# EAGLE design BaseMachine_Sequencer_UI_2 (EAGLE 7.2.0)
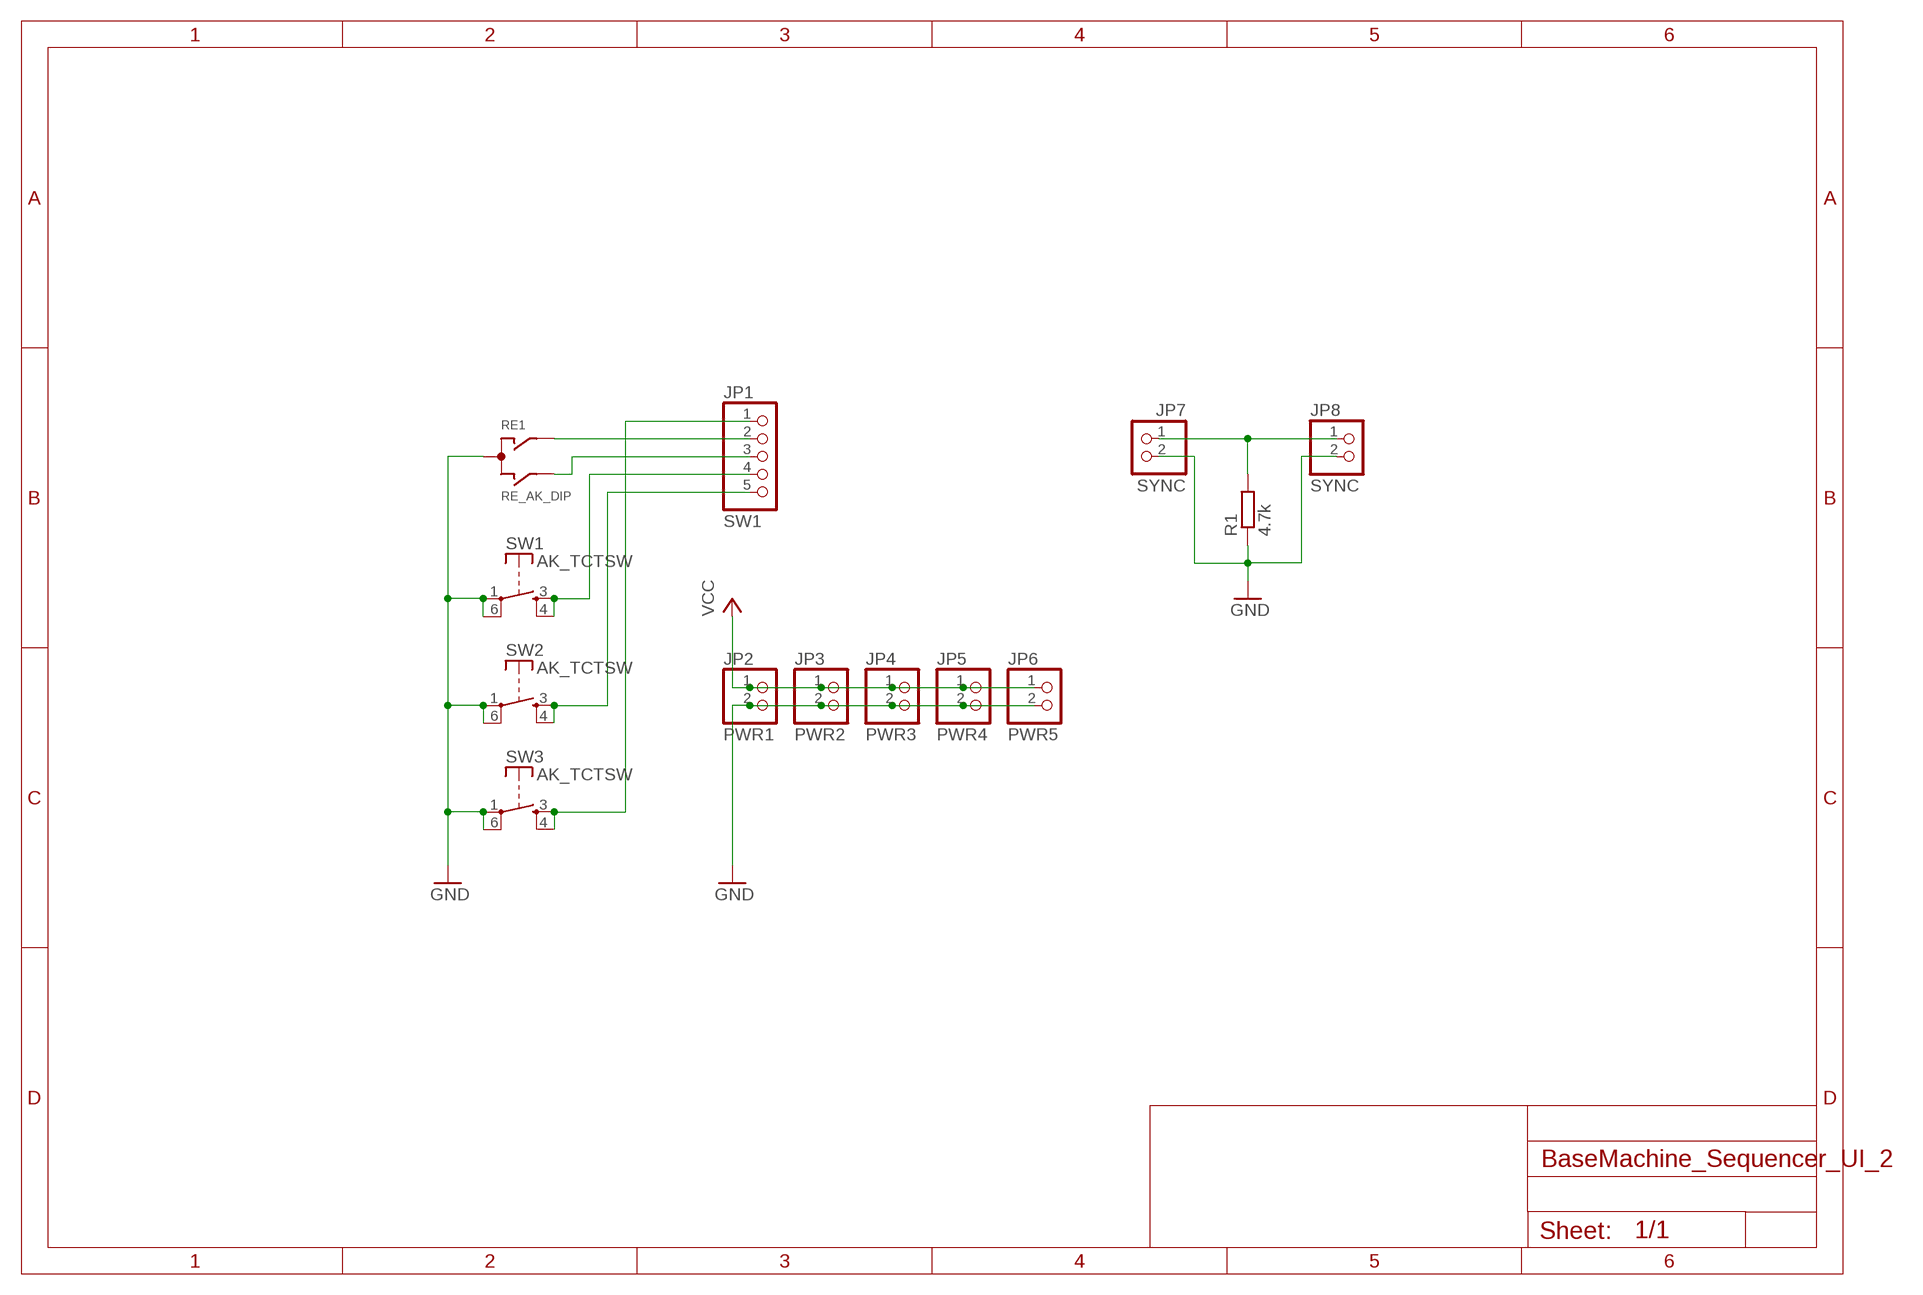
[diagram p0: schematic, sheet 1]

## Parts
JP1  SW1  PINHD-1X5/90  [1X05/90]
JP2  PWR1  PINHD-1X2/90  [1X02/90]
JP3  PWR2  PINHD-1X2  [1X02]
JP4  PWR3  PINHD-1X2  [1X02]
JP5  PWR4  PINHD-1X2  [1X02]
JP6  PWR5  PINHD-1X2  [1X02]
JP7  SYNC  PINHD-1X2/90  [1X02/90]
JP8  SYNC  PINHD-1X2  [1X02]
R1  4.7k  R-EU_0207/7  [0207/7]
RE1  RE_AK_DIP  [RE_AK_DIP]
SW1  AK_TCTSW  [TME1]
SW2  AK_TCTSW  [TME1]
SW3  AK_TCTSW  [TME1]

## Nets
GND: JP2.2 JP3.2 JP4.2 JP5.2 JP6.2 JP7.2 JP8.2 R1.1 RE1.P$3(C) SW1.1(P) SW1.6(P) SW2.1(P) SW2.6(P) SW3.1(P) SW3.6(P)
N$1: JP1.2 RE1.P$2(A)
N$2: JP1.5 SW2.3(S) SW2.4(S)
N$4: JP1.3 RE1.P$4(B)
N$5: JP1.4 SW1.3(S) SW1.4(S)
N$6: JP7.1 JP8.1 R1.2
N$7: JP1.1 SW3.3(S) SW3.4(S)
VCC: JP2.1 JP3.1 JP4.1 JP5.1 JP6.1

## Library data of the parts
JP1 = pinhead:PINHD-1X5: PIN HEADER
JP2-JP8 = pinhead:PINHD-1X2: PIN HEADER
R1 = rcl:R-EU_: RESISTOR, European symbol
RE1 = mylib2:RE_AK_DIP: 秋月 Rotary Encoder DIP化
SW1-SW3 = mylib2:AK_TCTSW

## Board
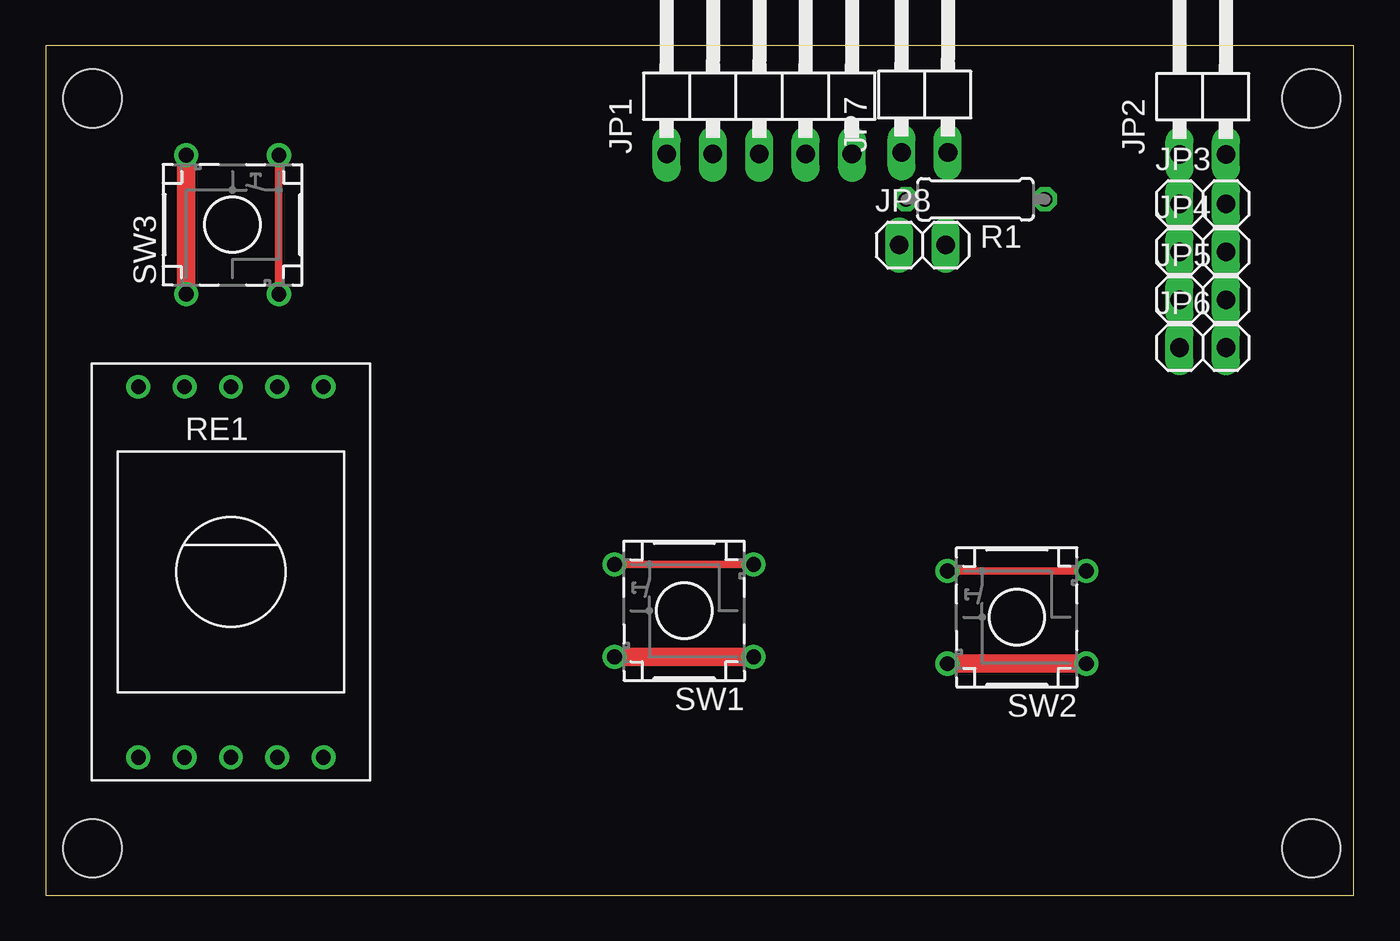
[diagram p1: board, top side]
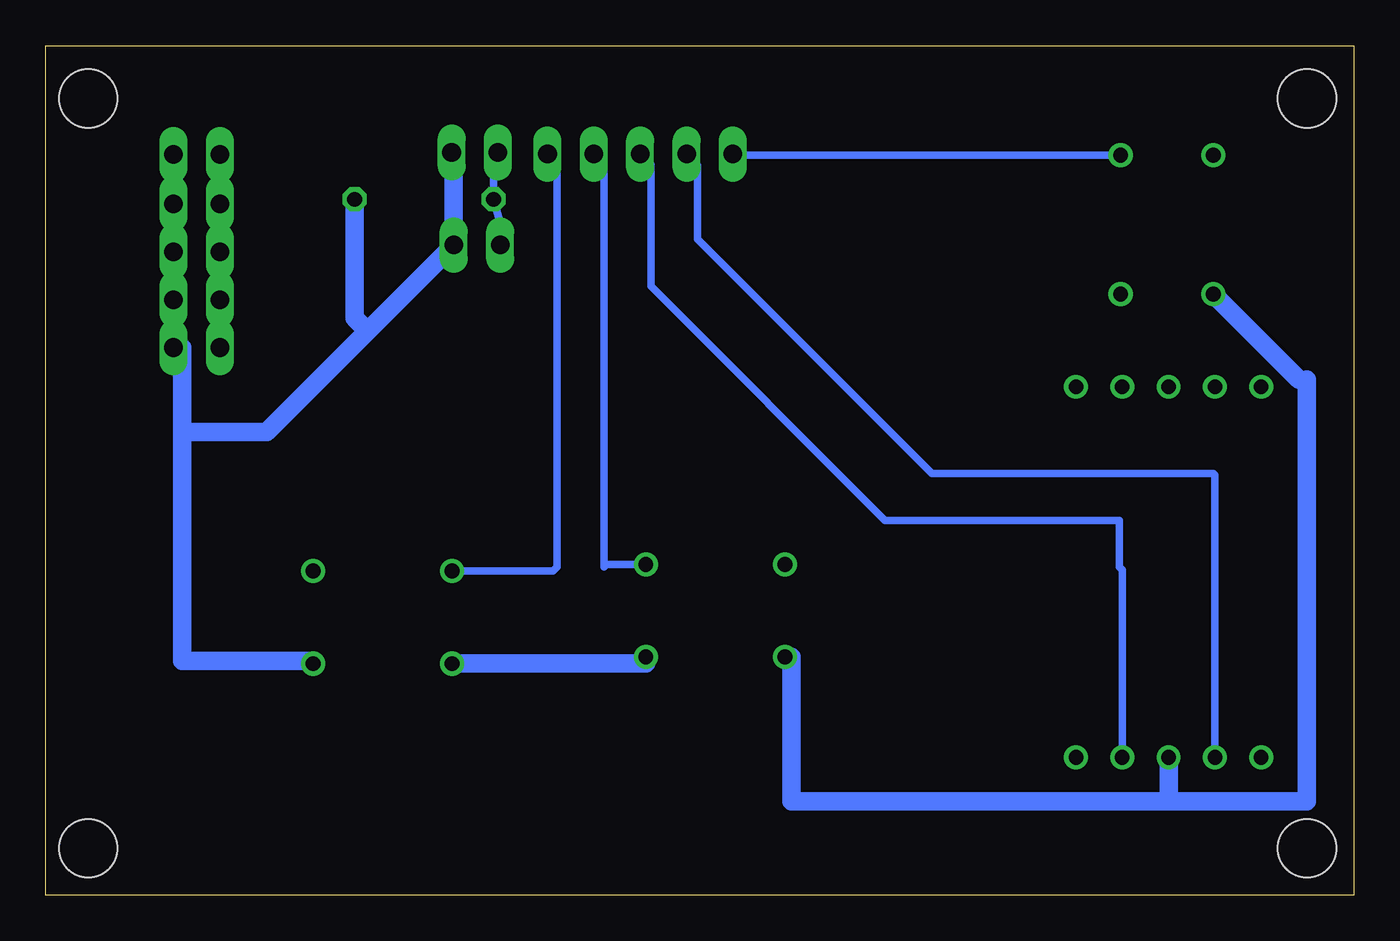
[diagram p2: board, bottom side, seen from below]

Size 71.73 x 46.59 mm. Coordinates in mm from the lower left corner, seen from the top.
Outline: 0,0 71.73,0 71.73,46.59 0,46.59 0,0
Copper layers (1*16): Top 0.035mm / dielectric 1.5mm / Bottom 0.035mm
Design rules "default": minimum track width 10mil, minimum drill 24mil, track to track 8mil, track to pad 8mil, pad to pad 8mil, via to via 8mil, smd to smd 8mil, copper to edge 40mil, drill to drill 8mil, minimum pad ring 10mil, minimum via ring 8mil, stop-mask expansion 4mil, vias tented up to drill 0mil, thermal gap 10mil
Holes 3.2 mm at 2.57,43.69 2.57,2.57 69.39,43.69 69.39,2.57

### Footprints (pad centres in the part's own frame; a part is rotated, then mirrored left to right if it is on the bottom)
1X05/90 = drill 1.016 long: 1 -5.08,-3.81; 2 -2.54,-3.81; 3 0,-3.81; 4 2.54,-3.81; 5 5.08,-3.81
1X02/90 = drill 1.016 long: 1 -1.27,-3.81; 2 1.27,-3.81
1X02 = drill 1.016 long: 1 -1.27,0; 2 1.27,0
0207/7 = drill 0.813 octagon: 1 -3.81,0; 2 3.81,0
RE_AK_DIP = drill 0.8: P$1 -5.08,-10.16; P$2 -2.54,-10.16; P$3 0,-10.16; P$4 2.54,-10.16; P$5 5.08,-10.16; P$6 -5.08,10.16; P$7 -2.54,10.16; P$8 0,10.16; P$9 2.54,10.16; P$10 5.08,10.16
TME1 = drill 0.813: 1 -2.54,-3.81; 3 2.54,-3.81; 4 2.54,3.81; 6 -2.54,3.81

### Placement (x,y rotation side)
JP1  39.13,44.45 0 top
JP2  63.44,44.42 0 top
JP3  63.44,37.92 0 top
JP4  63.44,35.29 0 top
JP5  63.44,32.66 0 top
JP6  63.44,30.03 0 top
JP7  48.2,44.54 0 top
JP8  48.08,35.65 0 top
R1  50.98,38.16 180 top
RE1  10.16,17.72 0 top
SW1  35.01,15.6 90 top
SW2  53.25,15.24 90 top
SW3  10.25,36.77 0 top

### Tracks (layer width: path | path; a pad name or v marks a point on that pad's centre or on a via)
GND
  Top 0.406: 56.54,12.7 56.54,12.85 57.06,12.85 SW2.1
  Top 1.016: SW3.6 SW3.1 | SW1.6 SW1.1 | SW2.6 56.54,12.7
  Bottom 0.406: JP6.2 64.25,30.03 | 57.06,12.85 SW2.1 | 38.82,12.7 SW1.1 | SW1.6 30.84,13.06 | 2.57,28.27 3.02,28.27 | 10.16,5.26 10.28,5.14 | JP7.2 49.35,40.73
  Bottom 1.016: JP2.2 JP3.2 JP4.2 JP5.2 JP6.2 | 64.25,30.03 64.25,25.7 | 64.25,25.7 64.25,12.85 57.06,12.85 | SW2.6 38.82,12.7 | 30.84,13.06 30.84,5.14 10.28,5.14 2.57,5.14 2.57,28.27 | 3.02,28.27 SW3.1 | RE1.P$3 10.16,5.26 | 49.35,40.73 JP8.2 54.06,30.93 | 64.25,25.7 63.95,25.4 59.6,25.4 54.06,30.93 | R1.1 54.79,31.66 54.06,30.93
N$1
  Bottom 0.406: RE1.P$2 7.62,23.04 7.71,23.13 23.13,23.13 35.98,35.98 35.98,40.03 JP1.2
N$2
  Top 0.406: SW2.4 SW2.3
  Bottom 0.406: SW2.4 43.9,17.78 43.69,17.99 43.69,40.12 JP1.5
N$4
  Bottom 0.406: RE1.P$4 12.7,17.84 12.85,17.99 12.85,20.56 25.7,20.56 38.55,33.41 38.55,40.06 JP1.3
N$5
  Top 0.406: SW1.4 38.55,18.14 38.55,17.99 38.82,17.99 SW1.3
  Bottom 0.406: SW1.3 40.97,18.14 41.12,17.99 41.12,40.09 JP1.4
N$6
  Bottom 0.406: JP7.1 47.17,40.73 R1.2 46.81,36.89 JP8.1
N$7
  Top 0.406: SW3.4 SW3.3
  Bottom 0.406: SW3.4 33.99,40.58 JP1.1
VCC
  Bottom 0.406: JP2.1 JP3.1 JP4.1 JP5.1 JP6.1